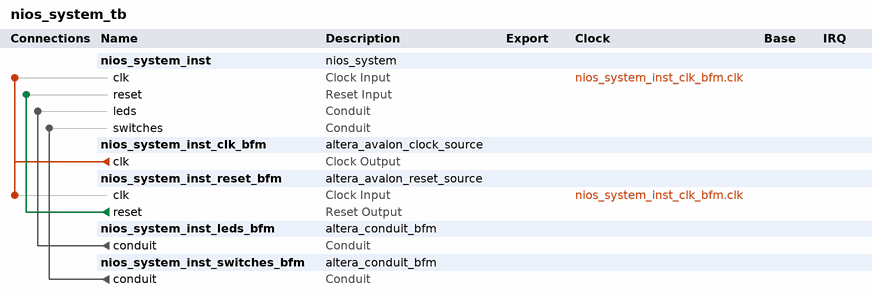
[diagram p0: system contents]
# Platform Designer (Qsys) system nios_system_tb, Cyclone V 5CSEMA5F31C6
# Parameters at their usual value, and those the tool derives, are not listed.
package require -exact qsys 18.0
create_system nios_system_tb
set_project_property DEVICE_FAMILY {Cyclone V}
set_project_property DEVICE 5CSEMA5F31C6

add_instance nios_system_inst nios_system 1.0

add_instance nios_system_inst_clk_bfm altera_avalon_clock_source 18.0

add_instance nios_system_inst_reset_bfm altera_avalon_reset_source 18.0
set_instance_parameter_value nios_system_inst_reset_bfm ASSERT_HIGH_RESET 0
set_instance_parameter_value nios_system_inst_reset_bfm INITIAL_RESET_CYCLES 50

add_instance nios_system_inst_leds_bfm altera_conduit_bfm 18.0
set_instance_parameter_value nios_system_inst_leds_bfm CLOCKED_SIGNAL false
set_instance_parameter_value nios_system_inst_leds_bfm ENABLE_RESET false
set_instance_parameter_value nios_system_inst_leds_bfm SIGNAL_DIRECTIONS input
set_instance_parameter_value nios_system_inst_leds_bfm SIGNAL_WIDTHS 8

add_instance nios_system_inst_switches_bfm altera_conduit_bfm 18.0
set_instance_parameter_value nios_system_inst_switches_bfm CLOCKED_SIGNAL false
set_instance_parameter_value nios_system_inst_switches_bfm ENABLE_RESET false
set_instance_parameter_value nios_system_inst_switches_bfm SIGNAL_DIRECTIONS output
set_instance_parameter_value nios_system_inst_switches_bfm SIGNAL_WIDTHS 8

# connections
add_connection nios_system_inst_clk_bfm.clk nios_system_inst.clk clock
add_connection nios_system_inst_clk_bfm.clk nios_system_inst_reset_bfm.clk clock
add_connection nios_system_inst_reset_bfm.reset nios_system_inst.reset reset
add_connection nios_system_inst_leds_bfm.conduit nios_system_inst.leds conduit
add_connection nios_system_inst_switches_bfm.conduit nios_system_inst.switches conduit

set_interconnect_requirement {$system} qsys_mm.clockCrossingAdapter HANDSHAKE
set_interconnect_requirement {$system} qsys_mm.enableEccProtection FALSE
set_interconnect_requirement {$system} qsys_mm.insertDefaultSlave FALSE
set_interconnect_requirement {$system} qsys_mm.maxAdditionalLatency 1

save_system nios_system_tb.qsys
